# Altium schematic sheet [1] Index (Table of Content).SchDoc
size OrCAD B; Organization: Altium Limited; Address1: L3, 12a Rodborough Rd; Address2: Frenchs Forest; Address3: NSW; Address4: Australia 2086; DocumentNumber: 1; SheetNumber: 1; SheetTotal: 16
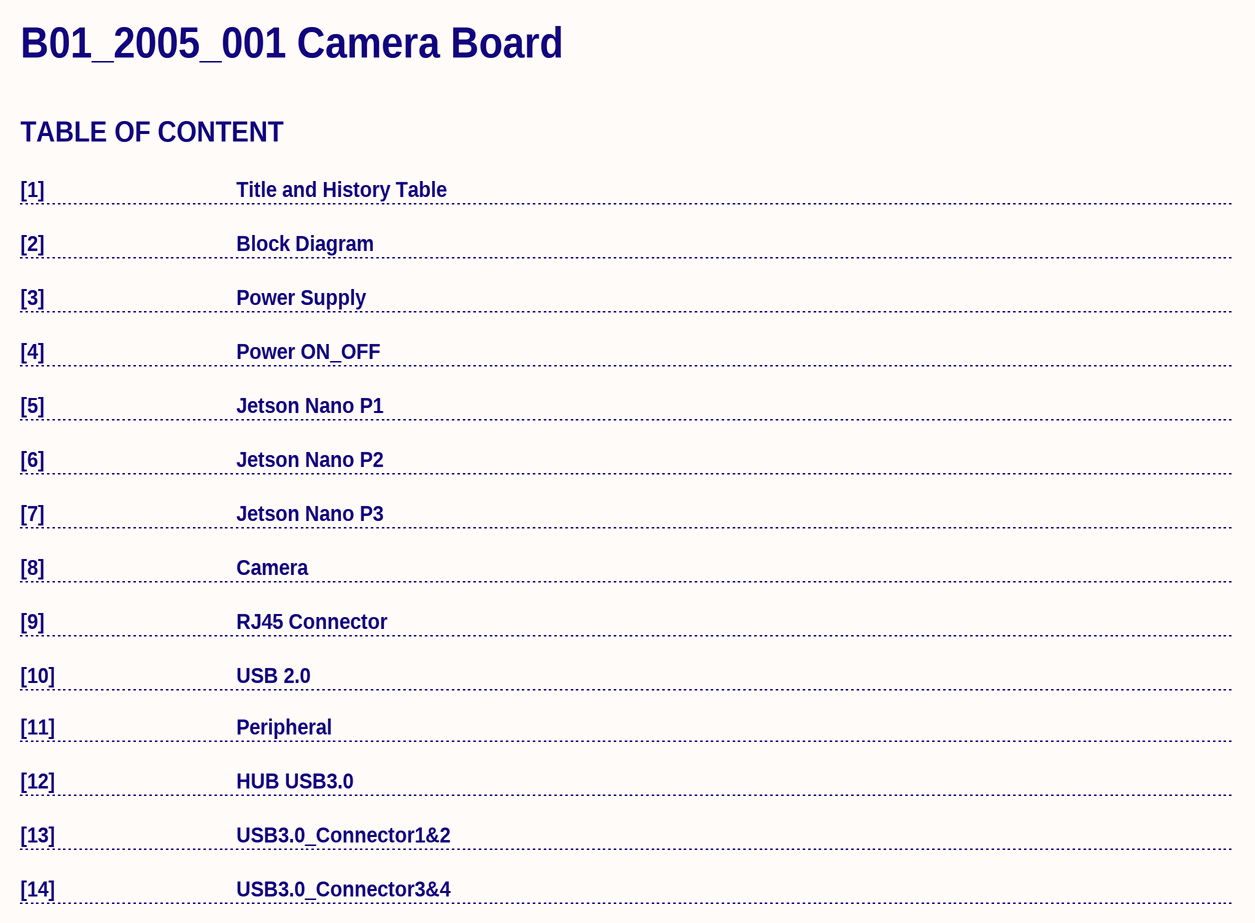
[diagram p0: [1] Index (Table of Content).SchDoc]

## Notes on the sheet
- B01_2005_001 Camera Board
- TABLE OF CONTENT
- [1]
- Title and History Table
- [2]
- Block Diagram
- [3]
- [4]
- Power Supply
- Power ON_OFF
- [5]
- Jetson Nano P1
- [6]
- Jetson Nano P2
- [7]
- Jetson Nano P3
- [8]
- [9]
- Camera
- RJ45 Connector
- [10]
- USB 2.0
- [11]
- Peripheral
- [12]
- HUB USB3.0
- [13]
- [14]
- USB3.0_Connector1&2
- USB3.0_Connector3&4
- Address: Vingroup A Building, Vinhomes Riverside
- No.7, Bang Lang Street, Long Bien District, Hanoi
- Title:
- Size
- Document Number:
- Engineer:
- Drawn By:
- Rev:
- Date:
- B
- Sheet
- of